# Altium schematic sheet SH4 - 3.3V LINEAR REGULATOR.SchDoc: =documentname
size B; Organization: UW Robotics; Address1: 200 University Avenue; Address2: Waterloo; Address3: Ontario; Address4: Canada N2L 3G6; DocumentNumber: 4; SheetNumber: 4
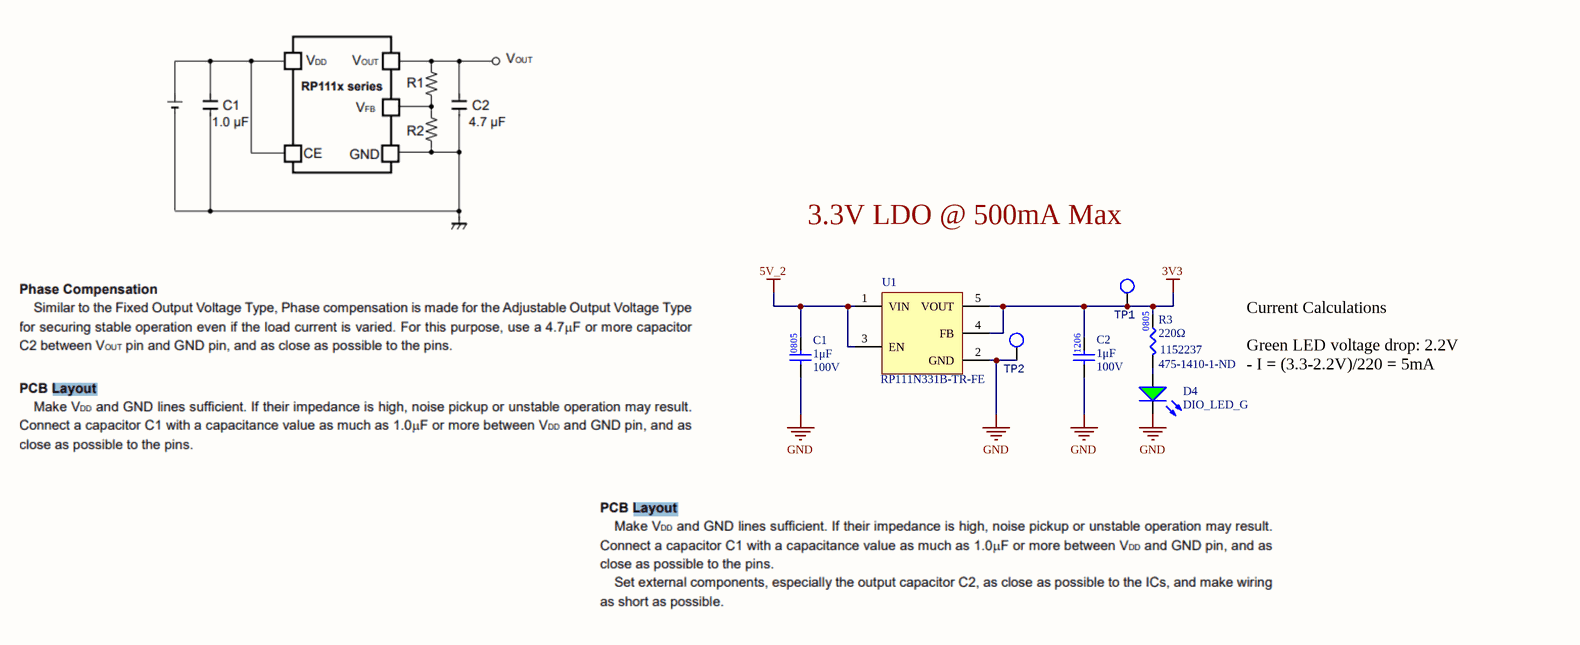
[diagram p0: SH4 - 3.3V LINEAR REGULATOR.SchDoc]

## Parts
C1  value 1μF  Voltage Rating: 100V  [CAP0805]  (hidden comment: CAP_1uF_100V_0805)
C2  value 1μF  Voltage Rating: 100V  [CAPC3216X190X50NL20T25]  (hidden comment: CAP_1uF_100V_1206)
D4  DIO_LED_G  Supplier Part Number 1: 475-1410-1-ND  Supplier Part Number 2: 1152237  [LED_0805_GREEN]
R3  value 220Ω  [RES0805]  (hidden comment: RES_220Ω_0805_5%)
TP1  TESTPOINT_LOOP  [TESTPOINT_LOOP]  (value not drawn)
TP2  TESTPOINT_LOOP  [TESTPOINT_LOOP]  (value not drawn)
U1  Manufacturer Part Number 1: RP111N331B-TR-FE  [SOT23-5]  (hidden comment: LDO_3.3V_500mA)

## Nets
3V3: C2.2 R3.2 TP1.1 U1.4(FB) U1.5(VOUT)
5V_2: C1.2 U1.1(VIN) U1.3(EN)
GND: C1.1 C2.1 D4.2(K) TP2.1 U1.2(GND)
NetD4_1: D4.1(A) R3.1

## Notes on the sheet
- 3.3V LDO @ 500mA Max
- Current Calculations
  Green LED voltage drop: 2.2V
  - I = (3.3-2.2V)/220 = 5mA
- Title:
- Project:
- Date:
- Rev:
- Reviewer:
- Engineer:
- Sheet:
- of

## Library data of the parts
C1 = CAP_1uF_100V_0805: CAP CER 1UF 100V X7S 0805; Supplier 1: Digi-Key; Mounting Type: SMD; Package: 0805; Supplier Part Number 1: 490-14464-1-ND
C2 = CAP_1uF_100V_1206: CAP CER 1UF 100V X7R 1206; Supplier 1: Digi-Key; Mounting Type: SMD; Package: 1206; Supplier Part Number 1: 490-16468-1-ND
D4 = DIO_LED_G: LED GREEN DIFFUSED 0805 SMD; Manufacturer Part Number 1: LG R971-KN-1; Manufacturer 1: OSRAM; Forward Voltage Drop: 2.2V; Package/Footprint: 0805; Mounting Type: SMD; Supplier 1: Digi-Key; Supplier 2: Future Electronics
R3 = RES_220Ω_0805_5%: RES 220 OHM 5% 1/2W 0805; Manufacturer 1: Panasonic Electronic Components; Manufacturer Part Number 1: ERJ-P06J221V; Supplier Part Number 1: P220ADCT-ND; Supplier 1: Digi-Key; LCSC Part #: C17557; Mounting Type: SMD; Package: 0805
TP1 TP2 = TESTPOINT_LOOP: TESTPOINT THRUHOLE; Manufacturer 1: Keystone Electronics; Manufacturer Part Number 1: 5002; Package/Footprint: TH; Supplier 1: Digi-Key; Supplier Part Number 1: 36-5002-ND; Mounting Type: TH
U1 = LDO_3.3V_500mA: IC REG LINEAR 3.3V 500MA SOT23-5; Manufacturer 1: RICOH Electronic Devices Co., LTD.; Input Voltage (Max): 5.25V; Voltage Dropout (Max): 0.32V; Package/Footprint: SOT-25; Supplier 1: Digi-Key; Supplier Part Number 1: 2129-RP111N331B-TR-FECT-ND; Output Voltage (Fixed): 3.3V; Output Current: 500mA; Operating Temperature: -40°C - 85°C; Mounting Type: SMD